# Altium project protectipon.PrjPcb
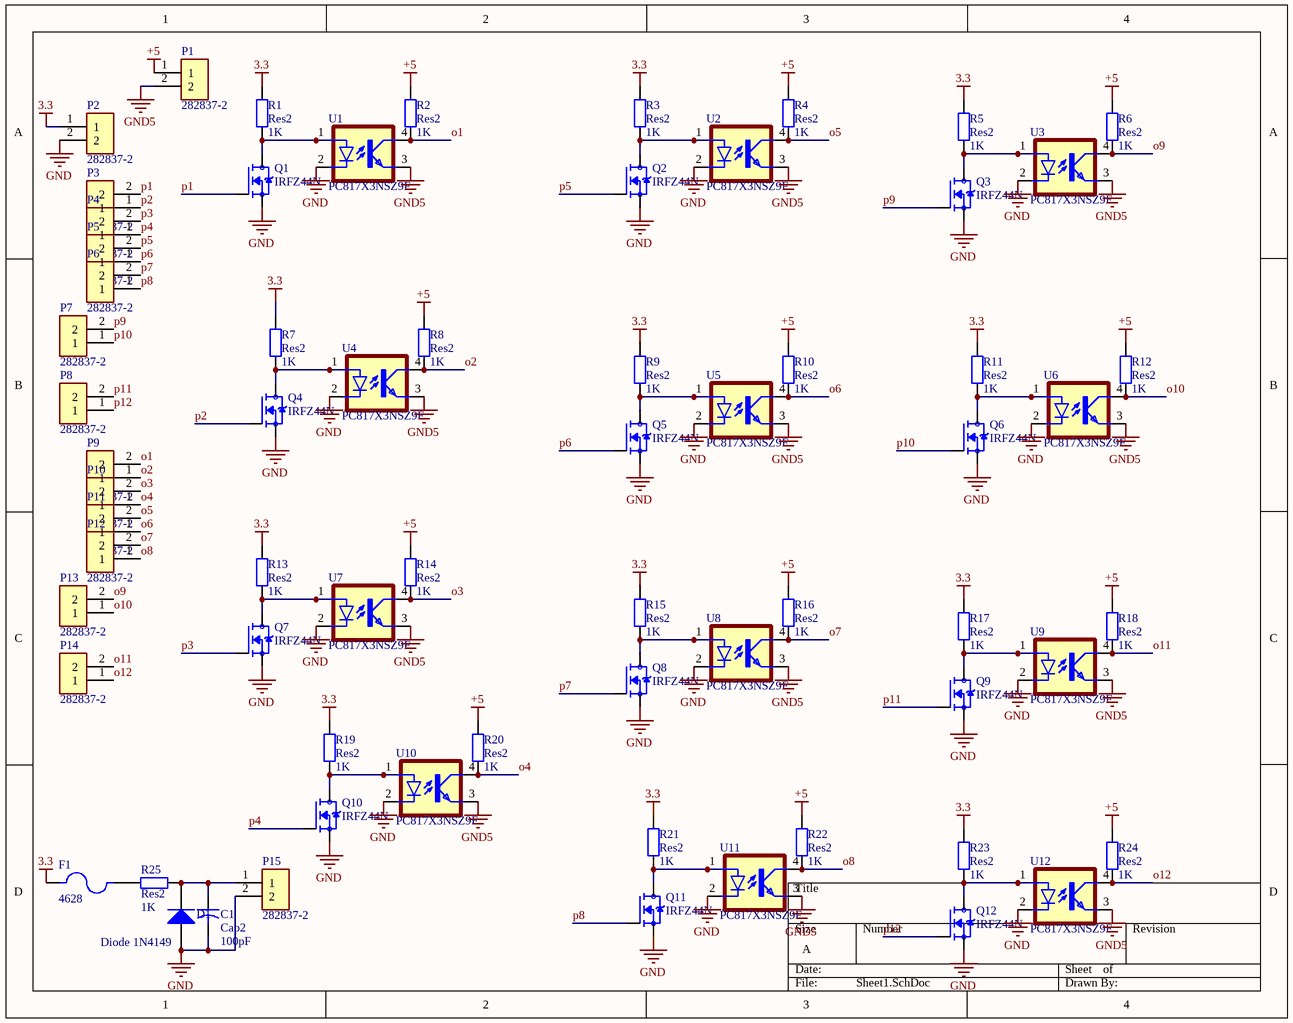
[diagram p0: Sheet1.SchDoc]
3 sheets, 138 parts. Net scope: global (net labels, ports and power ports of the same name join across sheets).
Board files: PCB1.PcbDoc, PCB2.PcbDoc, PCB3.PcbDoc
Sheets:
  Sheet1.SchDoc
  Sheet2.SchDoc
  Sheet3.SchDoc

## Sheet Sheet1.SchDoc
size A; SheetNumber: 1; SheetTotal: 1; SPICEModelCachePUKVLESM: <root> / <DocumentId>PUKVLESM</DocumentId> / <CacheFrame Number="0"> / <Model Name="1n4149" Kind="MDL"> / <Text>*1N4149 MCE 3-13-97 / *Ref: National Discrete Products Databook, 1996 / *75V 10mA Si Computer Diode pkg:DIODE0.4 1,2 / .MODEL 1N4149 D (IS=14.2P RS=4.2 N=1.7 BV=75 IBV=5U / + CJO=1.74P VJ=0.75 M=0.333 TT=4.32N)</Text> / </Model> / <Model Name="cap" Kind="MDL"> / <Text>*Default semiconductor capacitor / .MODEL CAP C()</Text> / </Model> / </CacheFrame> / </root>

### Parts
C1  Cap2  value 100pF  [CAPR5-4X5]
D1  Diode 1N4149  [DO-35A]
F1  4628  [FUSE_4628]
P1  282837-2  [TE_282837-2]
P2  282837-2  [TE_282837-2]
P3  282837-2  [TE_282837-2]
P4  282837-2  [TE_282837-2]
P5  282837-2  [TE_282837-2]
P6  282837-2  [TE_282837-2]
P7  282837-2  [TE_282837-2]
P8  282837-2  [TE_282837-2]
P9  282837-2  [TE_282837-2]
P10  282837-2  [TE_282837-2]
P11  282837-2  [TE_282837-2]
P12  282837-2  [TE_282837-2]
P13  282837-2  [TE_282837-2]
P14  282837-2  [TE_282837-2]
P15  282837-2  [TE_282837-2]
Q1  IRFZ44N  [TO254P1016X419X2286-3]
Q2  IRFZ44N  [TO254P1016X419X2286-3]
Q3  IRFZ44N  [TO254P1016X419X2286-3]
Q4  IRFZ44N  [TO254P1016X419X2286-3]
Q5  IRFZ44N  [TO254P1016X419X2286-3]
Q6  IRFZ44N  [TO254P1016X419X2286-3]
Q7  IRFZ44N  [TO254P1016X419X2286-3]
Q8  IRFZ44N  [TO254P1016X419X2286-3]
Q9  IRFZ44N  [TO254P1016X419X2286-3]
Q10  IRFZ44N  [TO254P1016X419X2286-3]
Q11  IRFZ44N  [TO254P1016X419X2286-3]
Q12  IRFZ44N  [TO254P1016X419X2286-3]
R1  Res2  value 1K  [AXIAL-0.4]
R2  Res2  value 1K  [AXIAL-0.4]
R3  Res2  value 1K  [AXIAL-0.4]
R4  Res2  value 1K  [AXIAL-0.4]
R5  Res2  value 1K  [AXIAL-0.4]
R6  Res2  value 1K  [AXIAL-0.4]
R7  Res2  value 1K  [AXIAL-0.4]
R8  Res2  value 1K  [AXIAL-0.4]
R9  Res2  value 1K  [AXIAL-0.4]
R10  Res2  value 1K  [AXIAL-0.4]
R11  Res2  value 1K  [AXIAL-0.4]
R12  Res2  value 1K  [AXIAL-0.4]
R13  Res2  value 1K  [AXIAL-0.4]
R14  Res2  value 1K  [AXIAL-0.4]
R15  Res2  value 1K  [AXIAL-0.4]
R16  Res2  value 1K  [AXIAL-0.4]
R17  Res2  value 1K  [AXIAL-0.4]
R18  Res2  value 1K  [AXIAL-0.4]
R19  Res2  value 1K  [AXIAL-0.4]
R20  Res2  value 1K  [AXIAL-0.4]
R21  Res2  value 1K  [AXIAL-0.4]
R22  Res2  value 1K  [AXIAL-0.4]
R23  Res2  value 1K  [AXIAL-0.4]
R24  Res2  value 1K  [AXIAL-0.4]
R25  Res2  value 1K  [AXIAL-0.4]
U1  PC817X3NSZ9F  [DIL04]
U2  PC817X3NSZ9F  [DIL04]
U3  PC817X3NSZ9F  [DIL04]
U4  PC817X3NSZ9F  [DIL04]
U5  PC817X3NSZ9F  [DIL04]
U6  PC817X3NSZ9F  [DIL04]
U7  PC817X3NSZ9F  [DIL04]
U8  PC817X3NSZ9F  [DIL04]
U9  PC817X3NSZ9F  [DIL04]
U10  PC817X3NSZ9F  [DIL04]
U11  PC817X3NSZ9F  [DIL04]
U12  PC817X3NSZ9F  [DIL04]

### Nets
3.3: F1.1 P2.1 R1.2 R3.2 R5.2 R7.2 R9.2 R11.2 R13.2 R15.2 R17.2 R19.2 R21.2 R23.2
+5: P1.1 R2.2 R4.2 R6.2 R8.2 R10.2 R12.2 R14.2 R16.2 R18.2 R20.2 R22.2 R24.2
GND: C1.2 D1.1(A) P2.2 P15.2 Q1.3(S) Q2.3(S) Q3.3(S) Q4.3(S) Q5.3(S) Q6.3(S) Q7.3(S) Q8.3(S) Q9.3(S) Q10.3(S) Q11.3(S) Q12.3(S) U1.2(C) U2.2(C) U3.2(C) U4.2(C) U5.2(C) U6.2(C) U7.2(C) U8.2(C) U9.2(C) U10.2(C) U11.2(C) U12.2(C)
GND5: P1.2 U1.3(EMIT) U2.3(EMIT) U3.3(EMIT) U4.3(EMIT) U5.3(EMIT) U6.3(EMIT) U7.3(EMIT) U8.3(EMIT) U9.3(EMIT) U10.3(EMIT) U11.3(EMIT) U12.3(EMIT)
o1: P9.2 R2.1 U1.4(COL)
o2: P9.1 R8.1 U4.4(COL)
o3: P10.2 R14.1 U7.4(COL)
o4: P10.1 R20.1 U10.4(COL)
o5: P11.2 R4.1 U2.4(COL)
o6: P11.1 R10.1 U5.4(COL)
o7: P12.2 R16.1 U8.4(COL)
o8: P12.1 R22.1 U11.4(COL)
o9: P13.2 R6.1 U3.4(COL)
o10: P13.1 R12.1 U6.4(COL)
o11: P14.2 R18.1 U9.4(COL)
o12: P14.1 R24.1 U12.4(COL)
p1: P3.2 Q1.1(G)
p2: P3.1 Q4.1(G)
p3: P4.2 Q7.1(G)
p4: P4.1 Q10.1(G)
p5: P5.2 Q2.1(G)
p6: P5.1 Q5.1(G)
p7: P6.2 Q8.1(G)
p8: P6.1 Q11.1(G)
p9: P7.2 Q3.1(G)
p10: P7.1 Q6.1(G)
p11: P8.2 Q9.1(G)
p12: P8.1 Q12.1(G)
NetC1_1: C1.1 D1.2(K) P15.1 R25.1
NetF1_2: F1.2 R25.2
NetQ1_2: Q1.2(D) R1.1 U1.1(A)
NetQ2_2: Q2.2(D) R3.1 U2.1(A)
NetQ3_2: Q3.2(D) R5.1 U3.1(A)
NetQ4_2: Q4.2(D) R7.1 U4.1(A)
NetQ5_2: Q5.2(D) R9.1 U5.1(A)
NetQ6_2: Q6.2(D) R11.1 U6.1(A)
NetQ7_2: Q7.2(D) R13.1 U7.1(A)
NetQ8_2: Q8.2(D) R15.1 U8.1(A)
NetQ9_2: Q9.2(D) R17.1 U9.1(A)
NetQ10_2: Q10.2(D) R19.1 U10.1(A)
NetQ11_2: Q11.2(D) R21.1 U11.1(A)
NetQ12_2: Q12.2(D) R23.1 U12.1(A)

### Library data of the parts
C1 = Cap2: Capacitor; Published: 23-Sep-2002; PackageReference: CAPR5-4X5; Publisher: Altium Limited; PackageDescription: Capacitor; 2 Leads
D1 = Diode 1N4149: Computer Diode; Published: 8-Jun-2000; LatestRevisionDate: 17-Jul-2002; LatestRevisionNote: Re-released for DXP Platform.; DatasheetVersion: 1989; PackageVersion: 1989; PackageReference: DO-35A; Publisher: Altium Limited; PackageDescription: Diode, Axial; Body 4.6 x 1.9 mm (LxDia. max), Lead Dia. 0.53 mm (max); Code_JEDEC: DO-204-AH; ComponentLink1Description: Manufacturer Link; ComponentLink1URL: http://www.national.com/
F1 = 4628: 5mm Slim Line Fuse holder; MF: Keystone; SnapEDA_Link: https://www.snapeda.com/parts/4628/Keystone/view-part/?ref=snap; Package: None; Value: *; MP: 4628; Check_prices: https://www.snapeda.com/parts/4628/Keystone/view-part/?ref=eda
P1-P15 = 282837-2: Ð Ð°Ð·ÑŠÐµÐ¼Ð½Ñ‹Ðµ ÐºÐ»ÐµÐ¼Ð¼Ð½Ñ‹Ðµ ÐºÐ¾Ð»Ð¾Ð´ÐºÐ¸ Ð Ð¾Ð·ÐµÑ‚ÐºÐ° 2 Ð¿Ð¾Ð»Ð¾Ð¶ÐµÐ½Ð¸Ñ 5,08 Ð¼Ð¼ ÐŸÑ€Ð¸Ð¿Ð¾Ð¹ Ð¿Ñ€ÑÐ¼Ð¾Ð¹ Ñ‡ÐµÑ€ÐµÐ· Ð¾Ñ‚Ð²ÐµÑ€ÑÑ‚Ð¸Ðµ 13,5 Ð / ÐºÐ¾Ð½Ñ‚Ð°ÐºÑ‚; MF: TE Connectivity; SnapEDA_Link: https://www.snapeda.com/parts/282837-2/TE+Connectivity+AMP+Connectors/view-part/?ref=snap; Price: None; Check_prices: https://www.snapeda.com/parts/282837-2/TE+Connectivity+AMP+Connectors/view-part/?ref=eda; Purchase-URL: https://pricing.snapeda.com/search/part/282837-2/?ref=eda; MP: 282837-2; Value: *; Availability: In Stock; Package: None
Q1-Q12 = IRFZ44N: N-Channel 55 V 49A (Tc) 94W (Tc) Through Hole TO-220AB; MF: Infineon Technologies; Check_prices: https://www.snapeda.com/parts/IRFZ44N/Infineon+Technologies/view-part/?ref=eda; Package: TO-220-3 Infineon; MP: IRFZ44N; Value: *; Availability: In Stock; Purchase-URL: https://pricing.snapeda.com/search/part/IRFZ44N/?ref=eda; SnapEDA_Link: https://www.snapeda.com/parts/IRFZ44N/Infineon+Technologies/view-part/?ref=snap; Price: None
R1-R25 = Res2: Resistor; Published: 8-Jun-2000; LatestRevisionDate: 17-Jul-2002; LatestRevisionNote: Re-released for DXP Platform.; PackageReference: AXIAL-0.4; Publisher: Altium Limited; PackageDescription: Axial Device, Thru-Hole; 2 Leads; 0.4 in Pin Spacing
U1-U12 = PC817X3NSZ9F: Optoisolator Transistor Output 5000Vrms 1 Channel 4-DIP; MF: Sharp Microelectronics; SnapEDA_Link: https://www.snapeda.com/parts/PC817X3NSZ9F/Sharp+Microelectronics/view-part/?ref=snap; Package: DIP-4 Sharp Microelectronics; Value: *; MP: PC817X3NSZ9F; Check_prices: https://www.snapeda.com/parts/PC817X3NSZ9F/Sharp+Microelectronics/view-part/?ref=eda

## Sheet Sheet2.SchDoc
size A; SheetNumber: 2; SheetTotal: 2; SPICEModelCacheROXHESGZ: <root> / <DocumentId>ROXHESGZ</DocumentId> / <CacheFrame Number="0"> / <Model Name="cap" Kind="MDL"> / <Text>*Default semiconductor capacitor / .MODEL CAP C()</Text> / </Model> / <Model Name="1n4149" Kind="MDL"> / <Text>*1N4149 MCE 3-13-97 / *Ref: National Discrete Products Databook, 1996 / *75V 10mA Si Computer Diode pkg:DIODE0.4 1,2 / .MODEL 1N4149 D (IS=14.2P RS=4.2 N=1.7 BV=75 IBV=5U / + CJO=1.74P VJ=0.75 M=0.333 TT=4.32N)</Text> / </Model> / </CacheFrame> / </root>
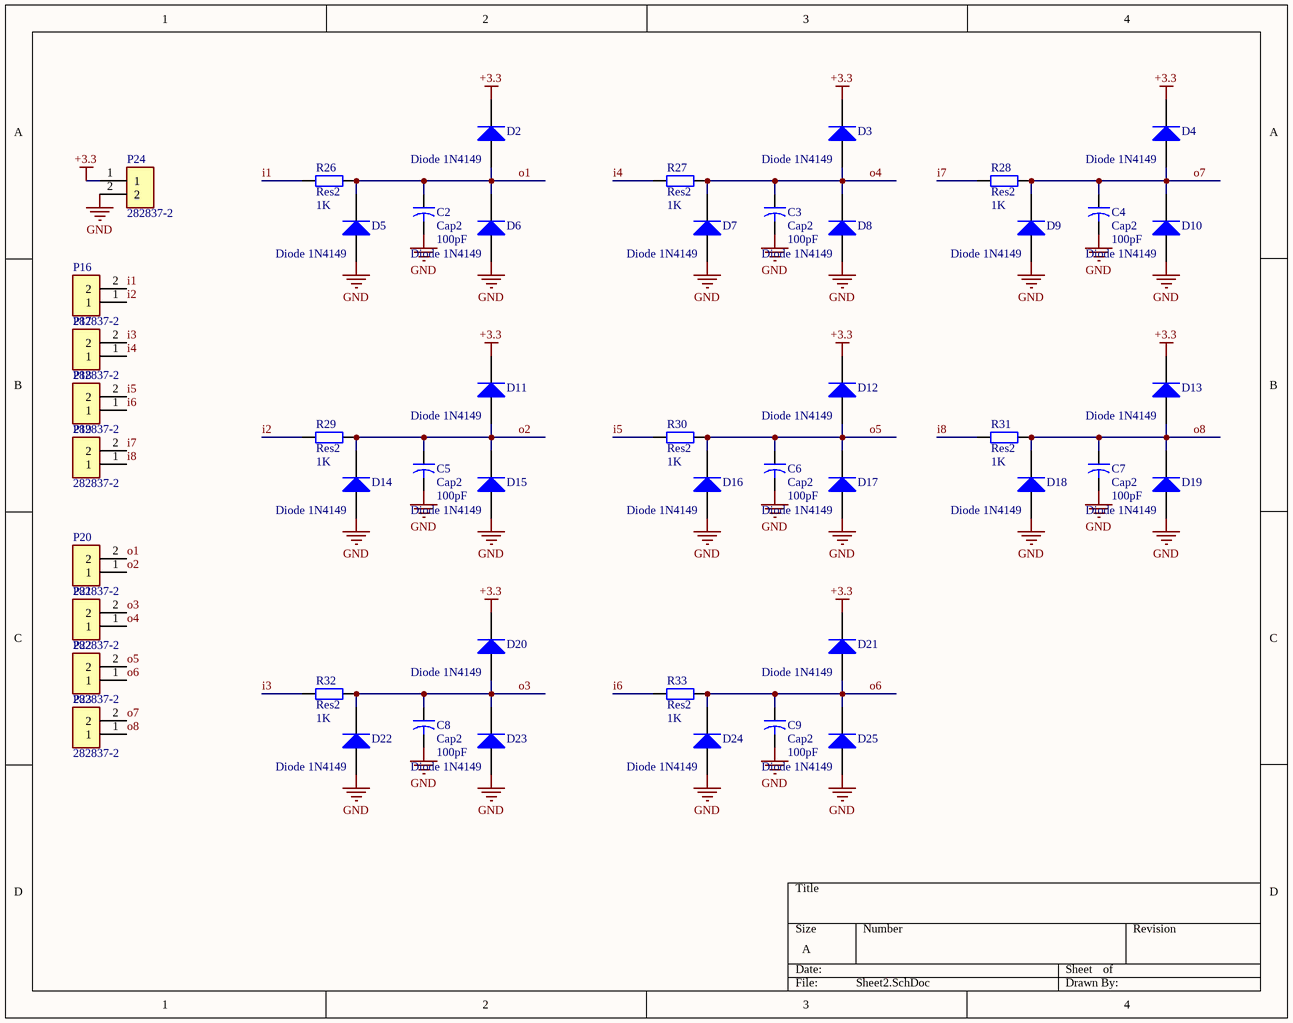
[diagram p1: Sheet2.SchDoc]

### Parts
C2  Cap2  value 100pF  [CAPR5-4X5]
C3  Cap2  value 100pF  [CAPR5-4X5]
C4  Cap2  value 100pF  [CAPR5-4X5]
C5  Cap2  value 100pF  [CAPR5-4X5]
C6  Cap2  value 100pF  [CAPR5-4X5]
C7  Cap2  value 100pF  [CAPR5-4X5]
C8  Cap2  value 100pF  [CAPR5-4X5]
C9  Cap2  value 100pF  [CAPR5-4X5]
D2  Diode 1N4149  [DO-35A]
D3  Diode 1N4149  [DO-35A]
D4  Diode 1N4149  [DO-35A]
D5  Diode 1N4149  [DO-35A]
D6  Diode 1N4149  [DO-35A]
D7  Diode 1N4149  [DO-35A]
D8  Diode 1N4149  [DO-35A]
D9  Diode 1N4149  [DO-35A]
D10  Diode 1N4149  [DO-35A]
D11  Diode 1N4149  [DO-35A]
D12  Diode 1N4149  [DO-35A]
D13  Diode 1N4149  [DO-35A]
D14  Diode 1N4149  [DO-35A]
D15  Diode 1N4149  [DO-35A]
D16  Diode 1N4149  [DO-35A]
D17  Diode 1N4149  [DO-35A]
D18  Diode 1N4149  [DO-35A]
D19  Diode 1N4149  [DO-35A]
D20  Diode 1N4149  [DO-35A]
D21  Diode 1N4149  [DO-35A]
D22  Diode 1N4149  [DO-35A]
D23  Diode 1N4149  [DO-35A]
D24  Diode 1N4149  [DO-35A]
D25  Diode 1N4149  [DO-35A]
P16  282837-2  [TE_282837-2]
P17  282837-2  [TE_282837-2]
P18  282837-2  [TE_282837-2]
P19  282837-2  [TE_282837-2]
P20  282837-2  [TE_282837-2]
P21  282837-2  [TE_282837-2]
P22  282837-2  [TE_282837-2]
P23  282837-2  [TE_282837-2]
P24  282837-2  [TE_282837-2]
R26  Res2  value 1K  [AXIAL-0.4]
R27  Res2  value 1K  [AXIAL-0.4]
R28  Res2  value 1K  [AXIAL-0.4]
R29  Res2  value 1K  [AXIAL-0.4]
R30  Res2  value 1K  [AXIAL-0.4]
R31  Res2  value 1K  [AXIAL-0.4]
R32  Res2  value 1K  [AXIAL-0.4]
R33  Res2  value 1K  [AXIAL-0.4]

### Nets
+3.3: D2.2(K) D3.2(K) D4.2(K) D11.2(K) D12.2(K) D13.2(K) D20.2(K) D21.2(K) P24.1
GND: C2.2 C3.2 C4.2 C5.2 C6.2 C7.2 C8.2 C9.2 D5.1(A) D6.1(A) D7.1(A) D8.1(A) D9.1(A) D10.1(A) D14.1(A) D15.1(A) D16.1(A) D17.1(A) D18.1(A) D19.1(A) D22.1(A) D23.1(A) D24.1(A) D25.1(A) P24.2
i1: P16.2 R26.2
i2: P16.1 R29.2
i3: P17.2 R32.2
i4: P17.1 R27.2
i5: P18.2 R30.2
i6: P18.1 R33.2
i7: P19.2 R28.2
i8: P19.1 R31.2
o1: C2.1 D2.1(A) D5.2(K) D6.2(K) P20.2 R26.1
o2: C5.1 D11.1(A) D14.2(K) D15.2(K) P20.1 R29.1
o3: C8.1 D20.1(A) D22.2(K) D23.2(K) P21.2 R32.1
o4: C3.1 D3.1(A) D7.2(K) D8.2(K) P21.1 R27.1
o5: C6.1 D12.1(A) D16.2(K) D17.2(K) P22.2 R30.1
o6: C9.1 D21.1(A) D24.2(K) D25.2(K) P22.1 R33.1
o7: C4.1 D4.1(A) D9.2(K) D10.2(K) P23.2 R28.1
o8: C7.1 D13.1(A) D18.2(K) D19.2(K) P23.1 R31.1

### Library data of the parts
C2-C9 = Cap2: Capacitor; Published: 23-Sep-2002; PackageReference: CAPR5-4X5; Publisher: Altium Limited; PackageDescription: Capacitor; 2 Leads
D2-D25 = Diode 1N4149: Computer Diode; Published: 8-Jun-2000; LatestRevisionDate: 17-Jul-2002; LatestRevisionNote: Re-released for DXP Platform.; DatasheetVersion: 1989; PackageVersion: 1989; PackageReference: DO-35A; Publisher: Altium Limited; PackageDescription: Diode, Axial; Body 4.6 x 1.9 mm (LxDia. max), Lead Dia. 0.53 mm (max); Code_JEDEC: DO-204-AH; ComponentLink1Description: Manufacturer Link; ComponentLink1URL: http://www.national.com/
P16-P24 = 282837-2: as P1 on sheet Sheet1; SnapEDA_Link: https://www.snapeda.com/parts/282837-2/TE+Connectivity+AMP+Connectors/view-part/?ref=snap; Price: None; Check_prices: https://www.snapeda.com/parts/282837-2/TE+Connectivity+AMP+Connectors/view-part/?ref=eda; Purchase-URL: https://pricing.snapeda.com/search/part/282837-2/?ref=eda; MP: 282837-2; Value: *; Availability: In Stock; Package: None
R26-R33 = Res2: Resistor; Published: 8-Jun-2000; LatestRevisionDate: 17-Jul-2002; LatestRevisionNote: Re-released for DXP Platform.; PackageReference: AXIAL-0.4; Publisher: Altium Limited; PackageDescription: Axial Device, Thru-Hole; 2 Leads; 0.4 in Pin Spacing

## Sheet Sheet3.SchDoc
size A; SheetNumber: 3; SheetTotal: 3
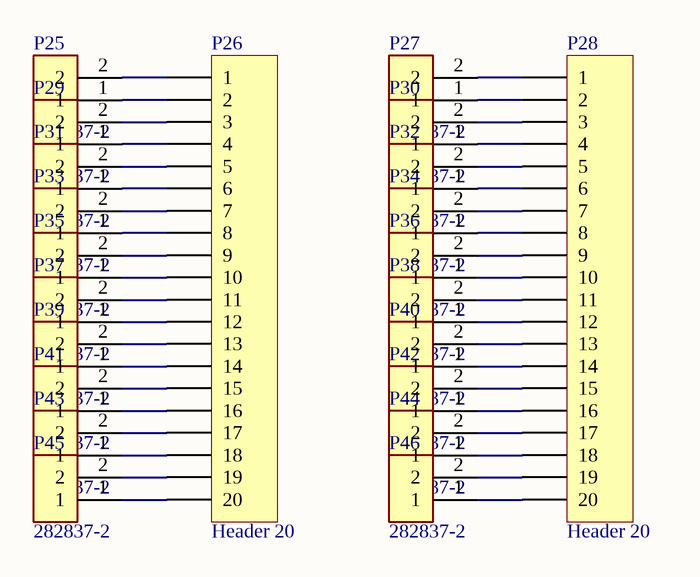
[diagram p2: Sheet3.SchDoc]

### Parts
P25  282837-2  [TE_282837-2]
P26  Header 20  [HDR1X20]
P27  282837-2  [TE_282837-2]
P28  Header 20  [HDR1X20]
P29  282837-2  [TE_282837-2]
P30  282837-2  [TE_282837-2]
P31  282837-2  [TE_282837-2]
P32  282837-2  [TE_282837-2]
P33  282837-2  [TE_282837-2]
P34  282837-2  [TE_282837-2]
P35  282837-2  [TE_282837-2]
P36  282837-2  [TE_282837-2]
P37  282837-2  [TE_282837-2]
P38  282837-2  [TE_282837-2]
P39  282837-2  [TE_282837-2]
P40  282837-2  [TE_282837-2]
P41  282837-2  [TE_282837-2]
P42  282837-2  [TE_282837-2]
P43  282837-2  [TE_282837-2]
P44  282837-2  [TE_282837-2]
P45  282837-2  [TE_282837-2]
P46  282837-2  [TE_282837-2]

### Nets
NetP25_1: P25.1 P26.2
NetP25_2: P25.2 P26.1
NetP26_3: P26.3 P29.2
NetP26_4: P26.4 P29.1
NetP26_5: P26.5 P31.2
NetP26_6: P26.6 P31.1
NetP26_7: P26.7 P33.2
NetP26_8: P26.8 P33.1
NetP26_9: P26.9 P35.2
NetP26_10: P26.10 P35.1
NetP26_11: P26.11 P37.2
NetP26_12: P26.12 P37.1
NetP26_13: P26.13 P39.2
NetP26_14: P26.14 P39.1
NetP26_15: P26.15 P41.2
NetP26_16: P26.16 P41.1
NetP26_17: P26.17 P43.2
NetP26_18: P26.18 P43.1
NetP26_19: P26.19 P45.2
NetP26_20: P26.20 P45.1
NetP27_1: P27.1 P28.2
NetP27_2: P27.2 P28.1
NetP28_3: P28.3 P30.2
NetP28_4: P28.4 P30.1
NetP28_5: P28.5 P32.2
NetP28_6: P28.6 P32.1
NetP28_7: P28.7 P34.2
NetP28_8: P28.8 P34.1
NetP28_9: P28.9 P36.2
NetP28_10: P28.10 P36.1
NetP28_11: P28.11 P38.2
NetP28_12: P28.12 P38.1
NetP28_13: P28.13 P40.2
NetP28_14: P28.14 P40.1
NetP28_15: P28.15 P42.2
NetP28_16: P28.16 P42.1
NetP28_17: P28.17 P44.2
NetP28_18: P28.18 P44.1
NetP28_19: P28.19 P46.2
NetP28_20: P28.20 P46.1

### Library data of the parts
P25 P27 P29-P46 = 282837-2: as P1 on sheet Sheet1; Price: None; Check_prices: https://www.snapeda.com/parts/282837-2/TE+Connectivity+AMP+Connectors/view-part/?ref=eda; Purchase-URL: https://pricing.snapeda.com/search/part/282837-2/?ref=eda; MP: 282837-2; Value: *; Availability: In Stock; Package: None
  P25 P27 P29-P45: SnapEDA_Link: https://www.snapeda.com/parts/282837-2/TE+Connectivity+AMP+Connectors/view-part/?ref=snap
P26 P28 = Header 20: Header, 20-Pin; LatestRevisionDate: 17-Jul-2002; LatestRevisionNote: Re-released for DXP Platform.; Publisher: Altium Limited

## Nets that join several sheets
GND: Sheet1 (28 pins), Sheet2 (25 pins)
o1: Sheet1 (P9.2 R2.1 U1.4), Sheet2 (6 pins)
o2: Sheet1 (P9.1 R8.1 U4.4), Sheet2 (6 pins)
o3: Sheet1 (P10.2 R14.1 U7.4), Sheet2 (6 pins)
o4: Sheet1 (P10.1 R20.1 U10.4), Sheet2 (6 pins)
o5: Sheet1 (P11.2 R4.1 U2.4), Sheet2 (6 pins)
o6: Sheet1 (P11.1 R10.1 U5.4), Sheet2 (6 pins)
o7: Sheet1 (P12.2 R16.1 U8.4), Sheet2 (6 pins)
o8: Sheet1 (P12.1 R22.1 U11.4), Sheet2 (6 pins)